# Altium schematic sheet StepperLogic.SchDoc
size A4
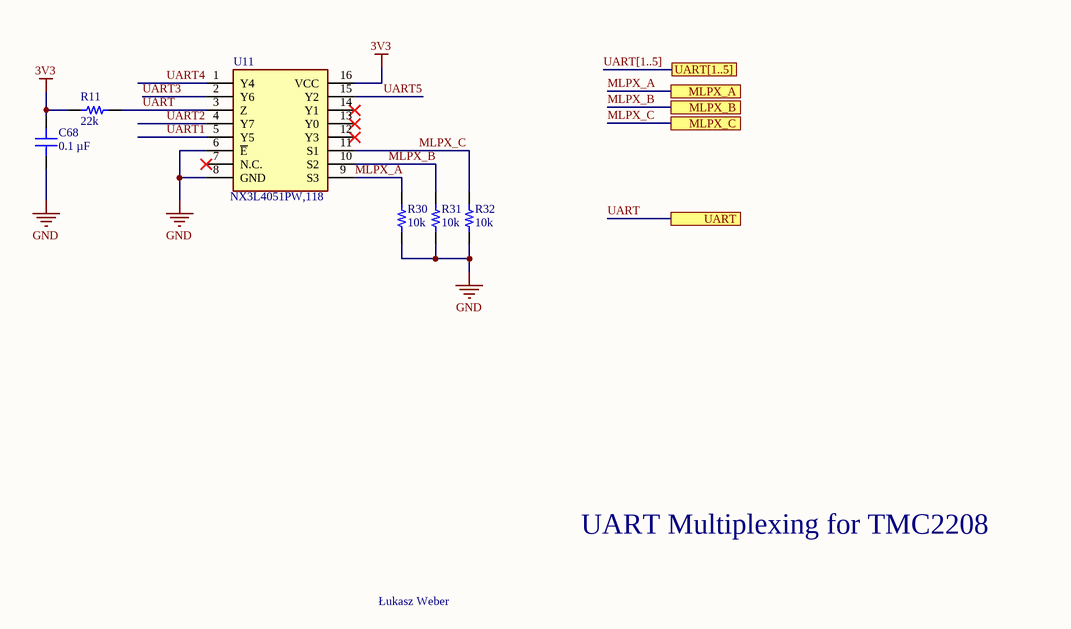
[diagram p0: StepperLogic.SchDoc]

## Parts
C68  0.1 µF  [CAP 0603_1608]
R11  22k  [RES 0603_1608]
R30  10k  [RES 0603_1608]
R31  10k  [RES 0603_1608]
R32  10k  [RES 0603_1608]
U11  NX3L4051PW,118  [SOP65P640X110-16N]

## Ports
MLPX_A, MLPX_B, MLPX_C, UART, UART[1..5]

## Nets
3V3: C68.2 R11.2 U11.16(VCC)
GND: C68.1 R30.2 R31.2 R32.2 U11.6(~{E}) U11.8(GND)
MLPX_A: R30.1 U11.9(S3) ; port MLPX_A
MLPX_B: R31.1 U11.10(S2) ; port MLPX_B
MLPX_C: R32.1 U11.11(S1) ; port MLPX_C
UART: R11.1 U11.3(Z) ; port UART
UART1: U11.5(Y5)
UART2: U11.4(Y7)
UART3: U11.2(Y6)
UART4: U11.1(Y4)
UART5: U11.15(Y2)

Not connected (* = marked no-connect by the designer): U11 7(N.C.)* 12(Y3)* 13(Y0)* 14(Y1)*

## Buses and harness runs
bus UART[1..5] = port UART[1..5]

## Notes on the sheet
- UART Multiplexing for TMC2208
- Łukasz Weber

## Library data of the parts
C68 = 0603B104K101CT: CAP CER 0.1UF 100V X7R 0603; manufacturer: Walsin Technology Corporation; Tolerance: ±10%; Part Number: 0603B104K101CT; Value: 0.1 µF; Applications: General Purpose; Capacitance: 0.1 µF; componentlink1description: Datasheet; componentlink1url: http://www.passivecomponent.com/wp-content/uploads/2018/10/MLCC.pdf; componentlink2description: DigiKey Link; componentlink2url: https://www.digikey.com/en/products/detail/walsin-technology-corporation/0603B104K101CT/9354889; Device Package: 0603 (1608 Metric); lastupdated: 4/8/2023 7:09:18 PM; Lifecycle Status: Active; Minimum Order: 1; Mounting Type: Surface Mount, MLCC; Operating Temperature: -55°C ~ 125°C; Package / Case: 0603 (1608 Metric); packaging: TapeAndReel; partid: 4273; Part Status: Active; price: 0.01; series: -; Size / Dimension: 0.063" L x 0.031" W (1.60mm x 0.80mm); Supplier 1: DigiKey; Supplier Part Number 1: 1292-1392-1-ND; Temperature Coefficient: X7R; Thickness (Max): 0.037" (0.95mm); Voltage - Rated: 100V
R11 = ERJ-UP3F2002V: RES 20K OHM 1% 1/4W 0603; Manufacturer: Panasonic Electronic Components; Power (Watts): 0.25W, 1/4W; Resistance: 20 kOhms; Temperature Coefficient: ±100ppm/°C; Part Number: ERJ-UP3F2002V; Value: 22k; ComponentLink1Description: Datasheet; ComponentLink1URL: https://b2b-api.panasonic.eu/file_stream/pids/fileversion/4484; ComponentLink2Description: DigiKey Link; ComponentLink2URL: https://www.digikey.com/en/products/detail/panasonic-electronic-components/ERJ-UP3F2002V/12092896; Composition: Thick Film; Device Package: 0603 (1608 Metric); Features: Anti-Sulfur, Automotive AEC-Q200, Pulse Withstanding; Height - Seated (Max): 0.022" (0.55mm); LastUpdated: 4/8/2023 7:29:07 PM; Lifecycle Status: Active; Minimum Order: 1; Number of Terminations: 2; Operating Temperature: -55°C ~ 155°C; Package / Case: 0603 (1608 Metric); Packaging: TapeAndReel; PartId: 63566; Part Status: Active; Price: 0.03; Ratings: AEC-Q200; Series: ERJ-UP3; Size / Dimension: 0.063" L x 0.031" W (1.60mm x 0.80mm); Supplier 1: DigiKey; Supplier Part Number 1: 10-ERJ-UP3F2002VCT-ND; Supplier Device Package: 0603; Tolerance: ±1%
R30-R32 = RC0603FR-7W10KL: RES 10K OHM 1% 1/5W 0603; Manufacturer: Yageo; Power (Watts): 0.2W, 1/5W; Resistance: 10 kOhms; Temperature Coefficient: ±200ppm/°C; Part Number: RC0603FR-7W10KL; Value: 10k; ComponentLink1Description: Datasheet; ComponentLink1URL: https://www.yageo.com/upload/media/product/productsearch/datasheet/rchip/PYu-RC_Group_51_RoHS_L_11.pdf; ComponentLink2Description: DigiKey Link; ComponentLink2URL: https://www.digikey.com/en/products/detail/yageo/RC0603FR-7W10KL/12698809; Composition: Thick Film; Device Package: 0603 (1608 Metric); Features: Moisture Resistant; Height - Seated (Max): 0.022" (0.55mm); LastUpdated: 4/8/2023 7:28:57 PM; Lifecycle Status: Active; Minimum Order: 1; Number of Terminations: 2; Operating Temperature: -55°C ~ 155°C; Package / Case: 0603 (1608 Metric); Packaging: CutTape; PartId: 67088; Part Status: Active; Price: 0.01; Series: RC_L; Size / Dimension: 0.063" L x 0.031" W (1.60mm x 0.80mm); Supplier 1: DigiKey; Supplier Part Number 1: 13-RC0603FR-7W10KLCT-ND; Supplier Device Package: 0603; Tolerance: ±1%
U11 = NX3L4051PW,118: Integrated Circuit; Manufacturer_Name: NXP; Datasheet Link: http://www.nxp.com/docs/en/data-sheet/NX3L4051.pdf; Height: 1.1mm; Manufacturer_Part_Number: NX3L4051PW,118; Mouser Part Number: 771-NX3L4051PW118; Mouser Price/Stock: https://www.mouser.co.uk/ProductDetail/NXP-Semiconductors/NX3L4051PW118?qs=vbj%2FKoHZRAgFepmnkfH0Pw%3D%3D; Arrow Part Number: NX3L4051PW,118; Arrow Price/Stock: https://www.arrow.com/en/products/nx3l4051pw118/nxp-semiconductors?region=nac